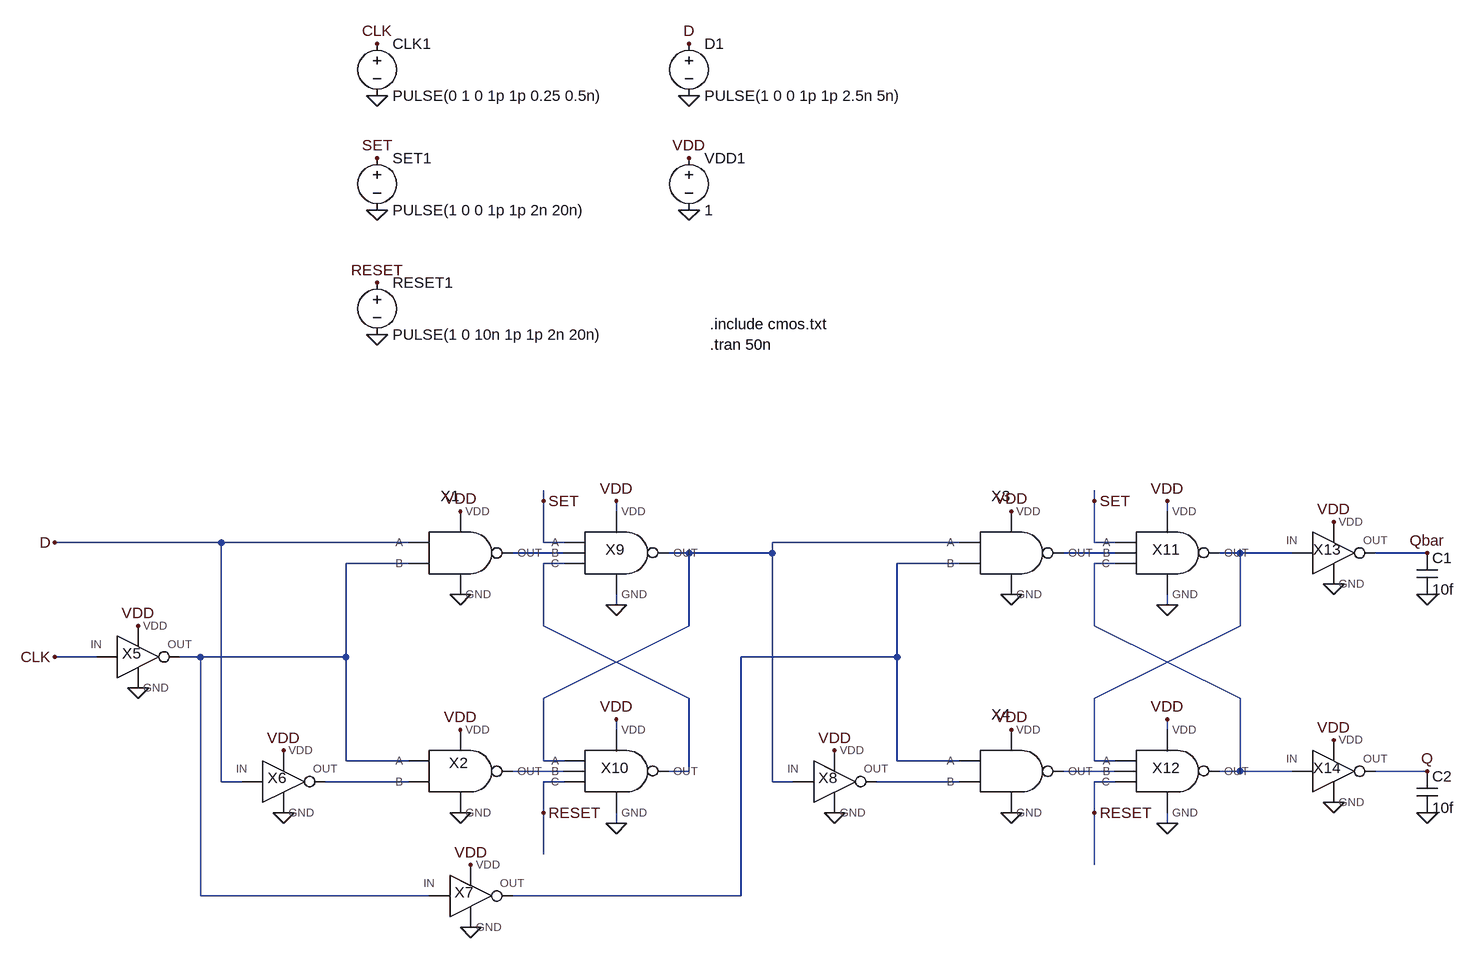
[diagram p0: schematic FFDLogic.asc]
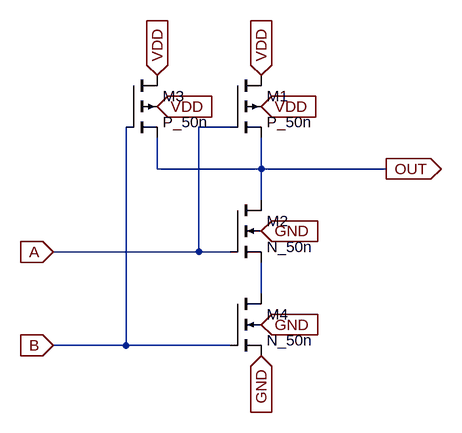
[diagram p1: sub-circuit nan2.asc]
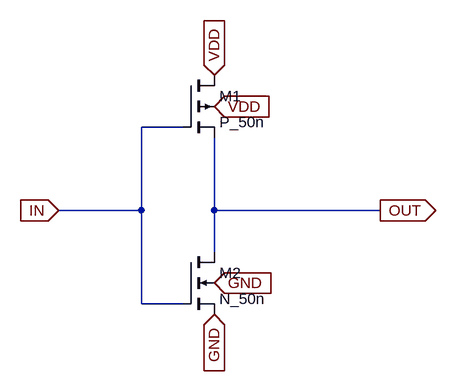
[diagram p2: sub-circuit inverter.asc]
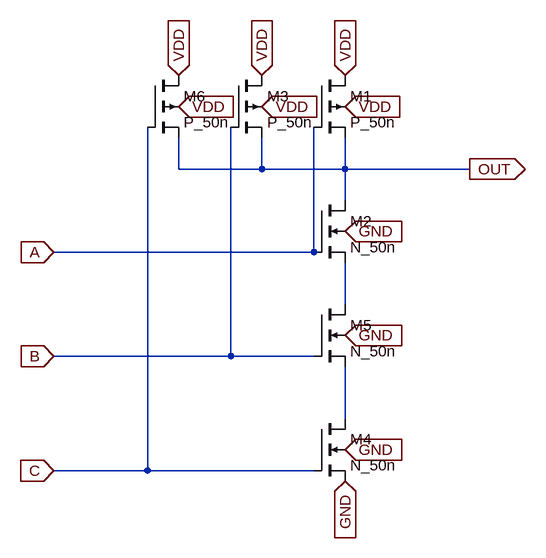
[diagram p3: sub-circuit nand3.asc]
FFDLogic.asc, the LTspice schematic file:
Version 4.1
SHEET 1 1988 1456
WIRE 448 768 448 752
WIRE 1296 768 1296 752
WIRE 560 784 560 768
WIRE 1408 784 1408 768
WIRE -48 832 -304 832
WIRE 240 832 -48 832
WIRE 448 832 448 768
WIRE 480 832 448 832
WIRE 1088 832 800 832
WIRE 1296 832 1296 768
WIRE 1328 832 1296 832
WIRE 480 848 400 848
WIRE 672 848 640 848
WIRE 800 848 800 832
WIRE 800 848 672 848
WIRE 1328 848 1248 848
WIRE 1520 848 1488 848
WIRE 1600 848 1520 848
WIRE 1808 848 1728 848
WIRE 240 864 144 864
WIRE 480 864 448 864
WIRE 1088 864 992 864
WIRE 1328 864 1296 864
WIRE 560 928 560 912
WIRE 1408 928 1408 912
WIRE 448 960 448 864
WIRE 672 960 672 848
WIRE 1296 960 1296 864
WIRE 1520 960 1520 848
WIRE -240 1008 -304 1008
WIRE -80 1008 -112 1008
WIRE 144 1008 144 864
WIRE 144 1008 -80 1008
WIRE 992 1008 992 864
WIRE 992 1008 752 1008
WIRE 448 1072 672 960
WIRE 672 1072 448 960
WIRE 1296 1072 1520 960
WIRE 1520 1072 1296 960
WIRE 560 1120 560 1104
WIRE 1408 1120 1408 1104
WIRE 144 1168 144 1008
WIRE 240 1168 144 1168
WIRE 448 1168 448 1072
WIRE 480 1168 448 1168
WIRE 992 1168 992 1008
WIRE 1088 1168 992 1168
WIRE 1296 1168 1296 1072
WIRE 1328 1168 1296 1168
WIRE 480 1184 400 1184
WIRE 672 1184 672 1072
WIRE 672 1184 640 1184
WIRE 1328 1184 1248 1184
WIRE 1520 1184 1520 1072
WIRE 1520 1184 1488 1184
WIRE 1600 1184 1520 1184
WIRE 1808 1184 1728 1184
WIRE -48 1200 -48 832
WIRE -16 1200 -48 1200
WIRE 240 1200 112 1200
WIRE 480 1200 448 1200
WIRE 800 1200 800 848
WIRE 832 1200 800 1200
WIRE 1088 1200 960 1200
WIRE 1328 1200 1296 1200
WIRE 448 1248 448 1200
WIRE 1296 1248 1296 1200
WIRE 560 1264 560 1248
WIRE 1408 1264 1408 1248
WIRE 448 1312 448 1248
WIRE 1296 1328 1296 1248
WIRE -80 1376 -80 1008
WIRE 272 1376 -80 1376
WIRE 752 1376 752 1008
WIRE 752 1376 400 1376
FLAG 192 144 0
FLAG 192 512 0
FLAG 192 320 0
FLAG 672 320 0
FLAG 672 144 0
FLAG 192 64 CLK
FLAG 672 64 D
FLAG 672 240 VDD
FLAG 192 240 SET
FLAG 192 432 RESET
FLAG -176 1056 0
FLAG 48 1248 0
FLAG 320 1248 0
FLAG 560 1264 0
FLAG 560 928 0
FLAG 320 912 0
FLAG 896 1248 0
FLAG 1408 1264 0
FLAG 1168 1248 0
FLAG 1408 928 0
FLAG 1168 912 0
FLAG -176 960 VDD
FLAG 320 784 VDD
FLAG 320 1120 VDD
FLAG 560 1104 VDD
FLAG 560 768 VDD
FLAG 896 1152 VDD
FLAG 1168 1120 VDD
FLAG 1408 1104 VDD
FLAG 1408 768 VDD
FLAG 1168 784 VDD
FLAG 1808 848 Qbar
FLAG 1808 1184 Q
FLAG 448 768 SET
FLAG 1296 768 SET
FLAG 448 1248 RESET
FLAG 1296 1248 RESET
FLAG -304 832 D
FLAG -304 1008 CLK
FLAG 48 1152 VDD
FLAG 1808 1248 0
FLAG 1808 912 0
FLAG 336 1424 0
FLAG 336 1328 VDD
FLAG 1664 1136 VDD
FLAG 1664 800 VDD
FLAG 1664 896 0
FLAG 1664 1232 0
SYMBOL voltage 672 224 R0
WINDOW 123 0 0 Left 0
WINDOW 39 0 0 Left 0
SYMATTR InstName VDD1
SYMATTR Value 1
SYMBOL voltage 672 48 R0
WINDOW 123 0 0 Left 0
WINDOW 39 0 0 Left 0
SYMATTR InstName D1
SYMATTR Value PULSE(1 0 0 1p 1p 2.5n 5n)
SYMBOL voltage 192 224 R0
WINDOW 123 0 0 Left 0
WINDOW 39 0 0 Left 0
SYMATTR InstName SET1
SYMATTR Value PULSE(1 0 0 1p 1p 2n 20n)
SYMBOL voltage 192 416 R0
WINDOW 123 0 0 Left 0
WINDOW 39 0 0 Left 0
SYMATTR InstName RESET1
SYMATTR Value PULSE(1 0 10n 1p 1p 2n 20n)
SYMBOL voltage 192 48 R0
WINDOW 123 0 0 Left 0
WINDOW 39 0 0 Left 0
SYMATTR InstName CLK1
SYMATTR Value PULSE(0 1 0 1p 1p 0.25 0.5n)
SYMBOL Lib\\NAN2 304 848 R0
SYMATTR InstName X1
SYMBOL Lib\\NAN2 304 1184 R0
WINDOW 0 13 3 Bottom 2
SYMATTR InstName X2
SYMBOL Lib\\Inverter -176 1008 R0
SYMATTR InstName X5
SYMBOL Lib\\Inverter 48 1200 R0
SYMATTR InstName X6
SYMBOL Lib\\NAND3 544 848 R0
SYMATTR InstName X9
SYMBOL Lib\\NAND3 544 1184 R0
SYMATTR InstName X10
SYMBOL Lib\\NAN2 1152 848 R0
SYMATTR InstName X3
SYMBOL Lib\\NAN2 1152 1184 R0
SYMATTR InstName X4
SYMBOL Lib\\NAND3 1392 848 R0
SYMATTR InstName X11
SYMBOL Lib\\NAND3 1392 1184 R0
SYMATTR InstName X12
SYMBOL Lib\\Inverter 896 1200 R0
SYMATTR InstName X8
SYMBOL cap 1792 848 R0
SYMATTR InstName C1
SYMATTR Value 10f
SYMBOL cap 1792 1184 R0
SYMATTR InstName C2
SYMATTR Value 10f
SYMBOL Lib\\Inverter 336 1376 R0
SYMATTR InstName X7
SYMBOL Lib\\Inverter 1664 848 R0
SYMATTR InstName X13
SYMBOL Lib\\Inverter 1664 1184 R0
SYMATTR InstName X14
TEXT 704 496 Left 2 !.include cmos.txt\n.tran 50n

nan2.asc, the sub-circuit schematic file:
Version 4.1
SHEET 1 880 680
WIRE 64 48 16 48
WIRE -48 112 -48 64
WIRE 112 112 112 64
WIRE 112 112 -48 112
WIRE 304 112 112 112
WIRE 112 160 112 112
WIRE 16 240 16 48
WIRE 16 240 -208 240
WIRE 64 240 16 240
WIRE 112 304 112 256
WIRE -96 384 -96 48
WIRE -96 384 -208 384
WIRE 64 384 -96 384
FLAG -48 -32 VDD
IOPIN -48 -32 In
FLAG -48 16 VDD
IOPIN -48 16 In
FLAG 112 16 VDD
IOPIN 112 16 In
FLAG 112 -32 VDD
IOPIN 112 -32 In
FLAG 112 352 GND
IOPIN 112 352 In
FLAG 112 400 GND
IOPIN 112 400 In
FLAG 112 208 GND
IOPIN 112 208 In
FLAG -208 240 A
IOPIN -208 240 In
FLAG -208 384 B
IOPIN -208 384 In
FLAG 304 112 OUT
IOPIN 304 112 Out
SYMBOL pmos4 64 -32 R0
SYMATTR InstName M1
SYMATTR Value P_50n
SYMATTR Value2 l=50n w=6u
SYMBOL nmos4 64 160 R0
SYMATTR InstName M2
SYMATTR Value N_50n
SYMATTR Value2 l=50n w=4u
SYMBOL pmos4 -96 -32 R0
SYMATTR InstName M3
SYMATTR Value P_50n
SYMATTR Value2 l=50n w=6u
SYMBOL nmos4 64 304 R0
SYMATTR InstName M4
SYMATTR Value N_50n
SYMATTR Value2 l=50n w=4u

inverter.asc, the sub-circuit schematic file:
Version 4.1
SHEET 1 880 680
WIRE 192 160 128 160
WIRE 128 288 128 160
WIRE 128 288 0 288
WIRE 240 288 240 176
WIRE 496 288 240 288
WIRE 240 352 240 288
WIRE 128 432 128 288
WIRE 192 432 128 432
FLAG 240 400 GND
IOPIN 240 400 In
FLAG 240 448 GND
IOPIN 240 448 In
FLAG 240 80 VDD
IOPIN 240 80 In
FLAG 240 128 VDD
IOPIN 240 128 In
FLAG 0 288 IN
IOPIN 0 288 In
FLAG 496 288 OUT
IOPIN 496 288 Out
SYMBOL pmos4 192 80 R0
SYMATTR InstName M1
SYMATTR Value P_50n
SYMATTR Value2 l=50n w=6u
SYMBOL nmos4 192 352 R0
SYMATTR InstName M2
SYMATTR Value N_50n
SYMATTR Value2 l=50n w=2u

nand3.asc, the sub-circuit schematic file:
Version 4.1
SHEET 1 880 680
WIRE -16 -16 -16 -64
WIRE 112 -16 112 -64
WIRE 112 -16 -16 -16
WIRE 240 -16 240 -64
WIRE 240 -16 112 -16
WIRE 432 -16 240 -16
WIRE 240 32 240 -16
WIRE 192 112 192 -80
WIRE 192 112 -208 112
WIRE 240 192 240 128
WIRE 64 272 64 -80
WIRE 64 272 -208 272
WIRE 192 272 64 272
WIRE 240 368 240 288
WIRE -64 448 -64 -80
WIRE -64 448 -208 448
WIRE 192 448 -64 448
FLAG 112 -160 VDD
IOPIN 112 -160 In
FLAG 112 -112 VDD
IOPIN 112 -112 In
FLAG 240 -112 VDD
IOPIN 240 -112 In
FLAG 240 -160 VDD
IOPIN 240 -160 In
FLAG 240 416 GND
IOPIN 240 416 In
FLAG 240 464 GND
IOPIN 240 464 In
FLAG 240 80 GND
IOPIN 240 80 In
FLAG -208 112 A
IOPIN -208 112 In
FLAG -208 448 C
IOPIN -208 448 In
FLAG 432 -16 OUT
IOPIN 432 -16 Out
FLAG -208 272 B
IOPIN -208 272 In
FLAG -16 -160 VDD
IOPIN -16 -160 In
FLAG -16 -112 VDD
IOPIN -16 -112 In
FLAG 240 240 GND
IOPIN 240 240 In
SYMBOL pmos4 192 -160 R0
SYMATTR InstName M1
SYMATTR Value P_50n
SYMATTR Value2 l=50n w=6u
SYMBOL nmos4 192 32 R0
SYMATTR InstName M2
SYMATTR Value N_50n
SYMATTR Value2 l=50n w=6u
SYMBOL pmos4 64 -160 R0
SYMATTR InstName M3
SYMATTR Value P_50n
SYMATTR Value2 l=50n w=6u
SYMBOL nmos4 192 368 R0
SYMATTR InstName M4
SYMATTR Value N_50n
SYMATTR Value2 l=50n w=6u
SYMBOL nmos4 192 192 R0
SYMATTR InstName M5
SYMATTR Value N_50n
SYMATTR Value2 l=50n w=6u
SYMBOL pmos4 -64 -160 R0
SYMATTR InstName M6
SYMATTR Value P_50n
SYMATTR Value2 l=50n w=6u

The netlist it stands for:
* FFDLogic.asc
VDD1 VDD 0 1
V§D1 D 0 PULSE(1 0 0 1p 1p 2.5n 5n)
V§SET1 SET 0 PULSE(1 0 0 1p 1p 2n 20n)
V§RESET1 RESET 0 PULSE(1 0 10n 1p 1p 2n 20n)
V§CLK1 CLK 0 PULSE(0 1 0 1p 1p 0.25 0.5n)
X§X1 D N005 0 VDD N002 nan2
X§X2 N005 N011 0 VDD N009 nan2
X§X5 0 CLK VDD N005 inverter
X§X6 0 D VDD N011 inverter
X§X9 SET N002 N006 0 VDD N001 nand3
X§X10 N001 N009 RESET 0 VDD N006 nand3
X§X3 N001 N007 0 VDD N003 nan2
X§X4 N007 N012 0 VDD N010 nan2
X§X11 SET N003 N008 0 VDD N004 nand3
X§X12 N004 N010 RESET 0 VDD N008 nand3
X§X8 0 N001 VDD N012 inverter
C1 Qbar 0 10f
C2 Q 0 10f
X§X7 0 N005 VDD N007 inverter
X§X13 0 N004 VDD Qbar inverter
X§X14 0 N008 VDD Q inverter

* block symbol definitions
.subckt nan2 A B GND VDD OUT
M1 VDD A OUT VDD P_50n l=50n w=6u
M2 OUT A N001 GND N_50n l=50n w=4u
M3 VDD B OUT VDD P_50n l=50n w=6u
M4 N001 B GND GND N_50n l=50n w=4u
.ends nan2

.subckt inverter GND IN VDD OUT
M1 VDD IN OUT VDD P_50n l=50n w=6u
M2 OUT IN GND GND N_50n l=50n w=2u
.ends inverter

.subckt nand3 A B C GND VDD OUT
M1 VDD A OUT VDD P_50n l=50n w=6u
M2 OUT A N001 GND N_50n l=50n w=6u
M3 VDD B OUT VDD P_50n l=50n w=6u
M4 N002 C GND GND N_50n l=50n w=6u
M5 N001 B N002 GND N_50n l=50n w=6u
M6 VDD C OUT VDD P_50n l=50n w=6u
.ends nand3

.model NMOS NMOS
.model PMOS PMOS
.lib standard.mos
.include cmos.txt
.tran 50n
.backanno
.end